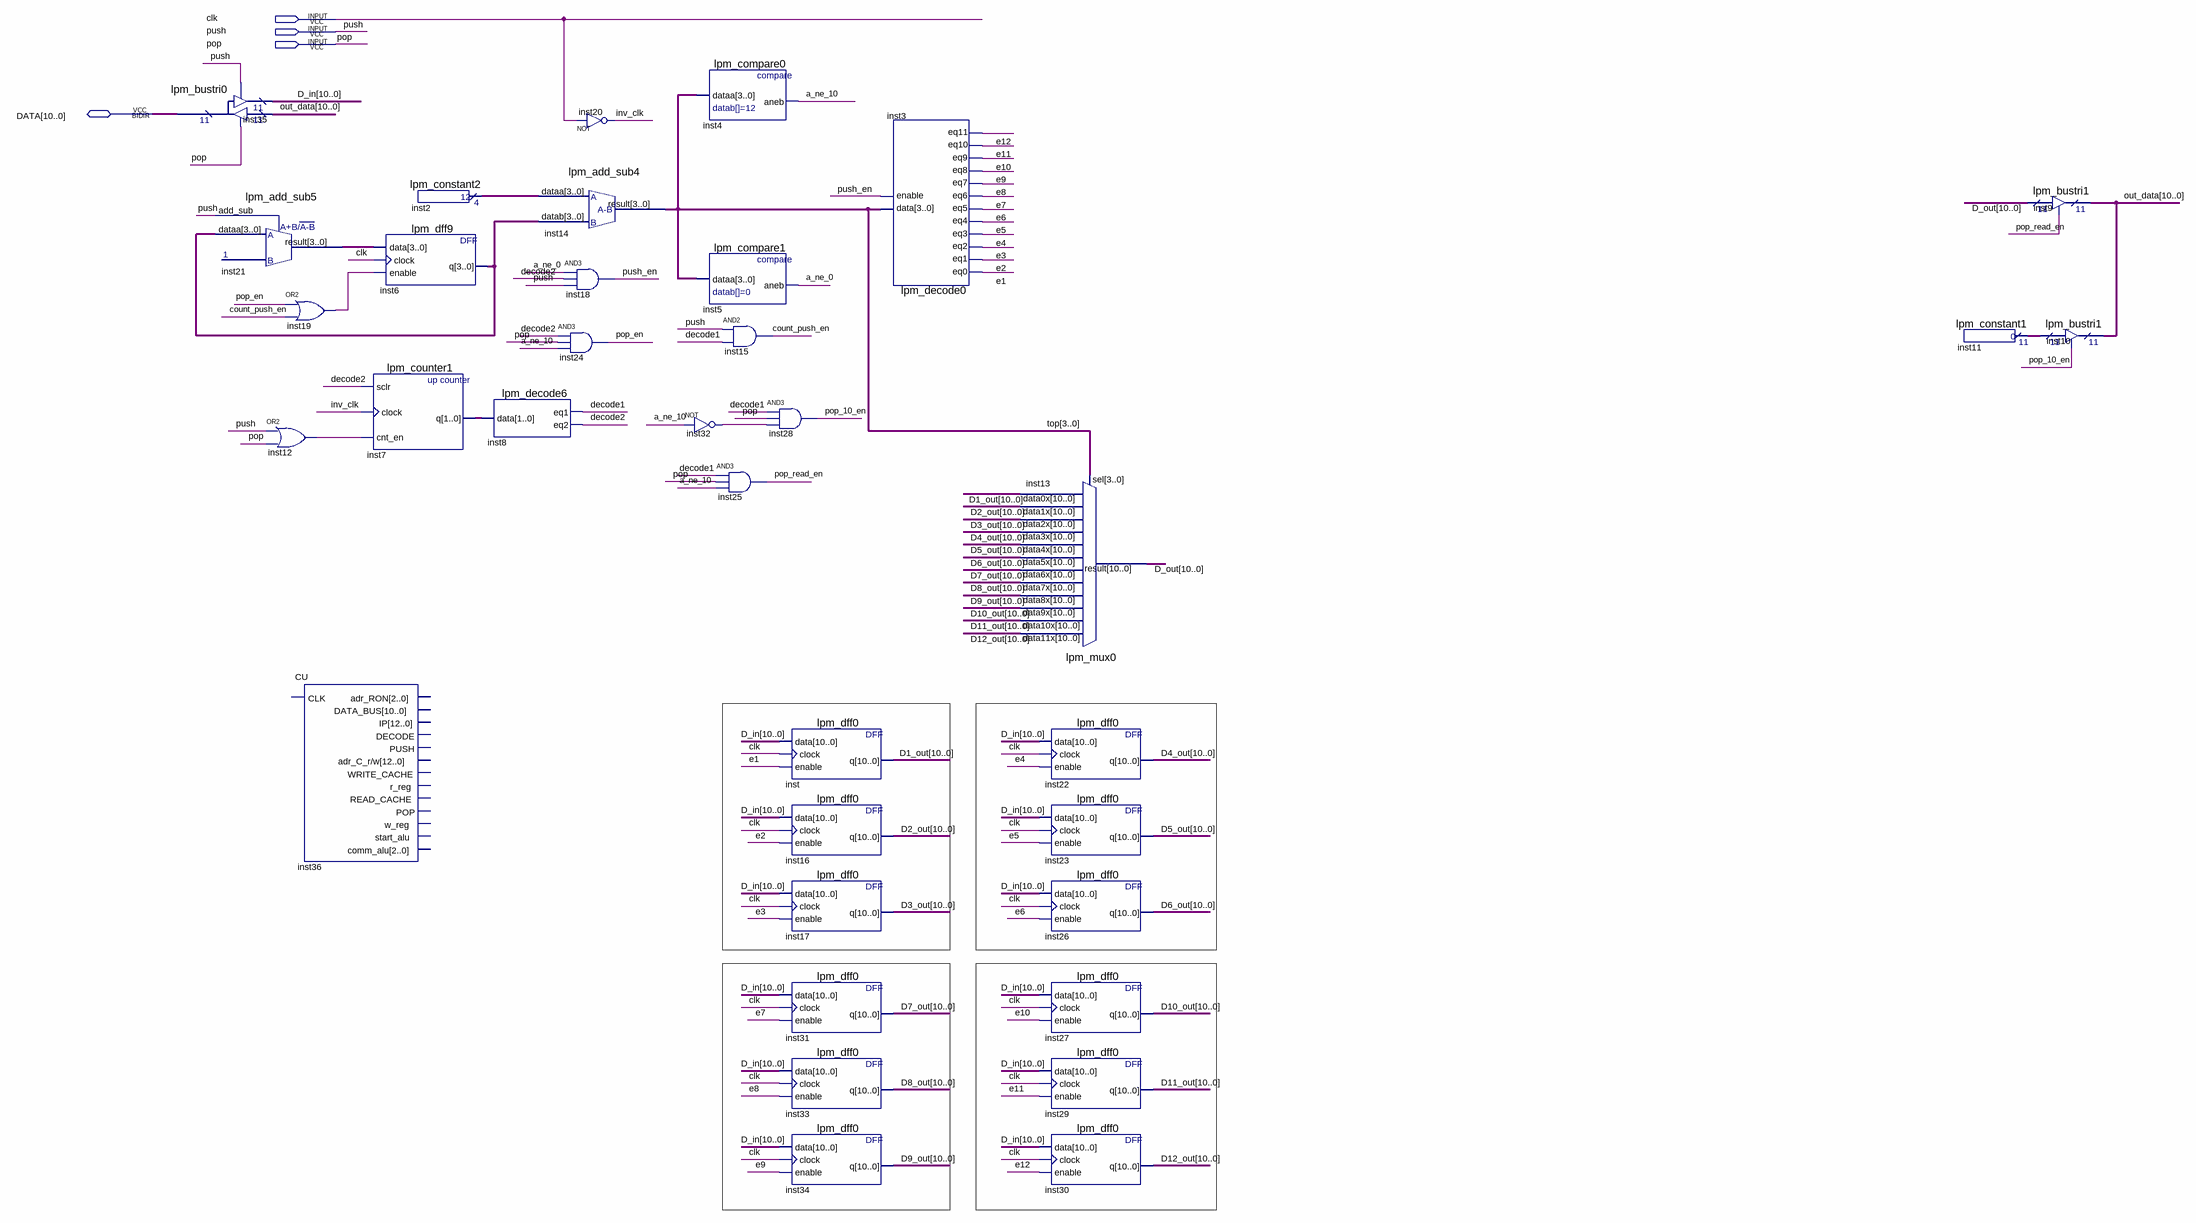
[diagram p0: schematic sheet]
// Quartus schematic ST.bdf as structural Verilog: 36 symbols, 4 pins
module ST (
  input  clk,
  input  push,
  input  pop,
  inout  [10:0] DATA
);

  wire a_ne_0, a_ne_10, count_push_en, decode1, decode2, e1, e2, e3, e4, e5, e6, e7, e8, e9, e10, e11, e12,
       inst12_out, inst19_out, inst32_out, inv_clk, pop_10_en, pop_en, pop_read_en, push_en;
  wire [1:0] inst7_q;
  wire [3:0] inst2_result, inst6_q, inst21_result, top;
  wire [10:0] D1_out, D2_out, D3_out, D4_out, D5_out, D6_out, D7_out, D8_out, D9_out, D10_out, D11_out,
       D12_out, D_in, D_out, inst11_result, out_data;

  lpm_bustri0 inst35 (.enabledt(pop), .data(out_data), .enabletr(push), .result(D_in), .tridata(DATA));
  lpm_add_sub5 inst21 (.dataa(inst6_q), .add_sub(push), .result(inst21_result));
  or inst12 (inst12_out, push, pop);
  or inst19 (inst19_out, pop_en, count_push_en);
  CU inst36 ();  // open: CLK, adr_RON, DATA_BUS, IP, DECODE, PUSH, adr_C_r/w, WRITE_CACHE, r_reg, READ_CACHE, POP, w_reg, start_alu, comm_alu
  lpm_dff9 inst6 (.data(inst21_result), .clock(clk), .enable(inst19_out), .q(inst6_q));
  lpm_counter1 inst7 (.sclr(decode2), .clock(inv_clk), .cnt_en(inst12_out), .q(inst7_q));
  lpm_constant2 inst2 (.result(inst2_result));
  lpm_decode6 inst8 (.data(inst7_q), .eq1(decode1), .eq2(decode2));
  not inst20 (inv_clk, clk);
  lpm_add_sub4 inst14 (.dataa(inst2_result), .datab(inst6_q), .result(top));
  and inst18 (push_en, a_ne_0, decode2, push);
  and inst24 (pop_en, decode2, pop, a_ne_10);
  lpm_compare0 inst4 (.dataa(top), .aneb(a_ne_10));
  lpm_compare1 inst5 (.dataa(top), .aneb(a_ne_0));
  and inst15 (count_push_en, push, decode1);
  not inst32 (inst32_out, a_ne_10);
  and inst25 (pop_read_en, decode1, pop, a_ne_10);
  and inst28 (pop_10_en, decode1, pop, inst32_out);
  lpm_dff0 inst (.data(D_in), .clock(clk), .enable(e1), .q(D1_out));
  lpm_dff0 inst16 (.data(D_in), .clock(clk), .enable(e2), .q(D2_out));
  lpm_dff0 inst17 (.data(D_in), .clock(clk), .enable(e3), .q(D3_out));
  lpm_dff0 inst31 (.data(D_in), .clock(clk), .enable(e7), .q(D7_out));
  lpm_dff0 inst33 (.data(D_in), .clock(clk), .enable(e8), .q(D8_out));
  lpm_dff0 inst34 (.data(D_in), .clock(clk), .enable(e9), .q(D9_out));
  lpm_decode0 inst3 (
    .data(top), .enable(push_en), .eq0(e1), .eq1(e2), .eq2(e3), .eq3(e4), .eq4(e5), .eq5(e6), .eq6(e7),
    .eq7(e8), .eq8(e9), .eq9(e10), .eq10(e11), .eq11(e12));
  lpm_mux0 inst13 (
    .data11x(D12_out), .data10x(D11_out), .data9x(D10_out), .data8x(D9_out), .data7x(D8_out),
    .data6x(D7_out), .data5x(D6_out), .data4x(D5_out), .data3x(D4_out), .data2x(D3_out), .data1x(D2_out),
    .data0x(D1_out), .sel(top), .result(D_out));
  lpm_dff0 inst22 (.data(D_in), .clock(clk), .enable(e4), .q(D4_out));
  lpm_dff0 inst23 (.data(D_in), .clock(clk), .enable(e5), .q(D5_out));
  lpm_dff0 inst26 (.data(D_in), .clock(clk), .enable(e6), .q(D6_out));
  lpm_dff0 inst27 (.data(D_in), .clock(clk), .enable(e10), .q(D10_out));
  lpm_dff0 inst29 (.data(D_in), .clock(clk), .enable(e11), .q(D11_out));
  lpm_dff0 inst30 (.data(D_in), .clock(clk), .enable(e12), .q(D12_out));
  lpm_constant1 inst11 (.result(inst11_result));
  lpm_bustri1 inst9 (.enabledt(pop_read_en), .data(D_out), .tridata(out_data));
  lpm_bustri1 inst10 (.enabledt(pop_10_en), .data(inst11_result), .tridata(out_data));
endmodule
